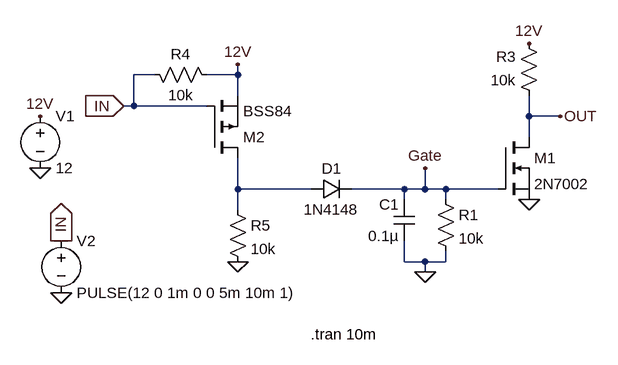
[diagram p0: schematic delay.asc]
delay.asc, the LTspice schematic file:
Version 4
SHEET 1 1112 680
WIRE -368 -16 -400 -16
WIRE -240 -16 -240 -32
WIRE -240 -16 -288 -16
WIRE -240 16 -240 -16
WIRE -400 32 -400 -16
WIRE -400 32 -416 32
WIRE -288 32 -400 32
WIRE 208 48 208 16
WIRE 256 48 208 48
WIRE 208 80 208 48
WIRE -240 160 -240 112
WIRE -128 160 -240 160
WIRE 16 160 -64 160
WIRE 48 160 48 128
WIRE 48 160 16 160
WIRE 80 160 48 160
WIRE 160 160 80 160
WIRE 16 176 16 160
WIRE 80 176 80 160
WIRE -240 192 -240 160
WIRE 16 272 16 240
WIRE 48 272 16 272
WIRE 80 272 80 256
WIRE 80 272 48 272
WIRE 48 288 48 272
FLAG -544 128 0
FLAG -512 320 0
FLAG -544 48 12V
FLAG -512 240 IN
IOPIN -512 240 Out
FLAG 48 288 0
FLAG 208 176 0
FLAG 256 48 OUT
FLAG 208 -64 12V
FLAG -240 -32 12V
FLAG -416 32 IN
IOPIN -416 32 In
FLAG -240 272 0
FLAG 48 128 Gate
SYMBOL voltage -544 32 R0
WINDOW 123 0 0 Left 0
WINDOW 39 0 0 Left 0
SYMATTR InstName V1
SYMATTR Value 12
SYMBOL voltage -512 224 R0
WINDOW 123 0 0 Left 0
WINDOW 39 0 0 Left 0
SYMATTR InstName V2
SYMATTR Value PULSE(12 0 1m 0 0 5m 10m 1)
SYMBOL diode -128 176 R270
WINDOW 0 32 32 VTop 2
WINDOW 3 0 32 VBottom 2
SYMATTR InstName D1
SYMATTR Value 1N4148
SYMBOL cap 32 176 M0
SYMATTR InstName C1
SYMATTR Value 0.1µ
SYMBOL res 64 160 R0
SYMATTR InstName R1
SYMATTR Value 10k
SYMBOL nmos 160 80 R0
SYMATTR InstName M1
SYMATTR Value 2N7002
SYMBOL res 224 32 R180
WINDOW 0 36 76 Left 2
WINDOW 3 36 40 Left 2
SYMATTR InstName R3
SYMATTR Value 10k
SYMBOL pmos -288 112 M180
SYMATTR InstName M2
SYMATTR Value BSS84
SYMBOL res -272 0 M270
WINDOW 0 32 56 VTop 2
WINDOW 3 0 56 VBottom 2
SYMATTR InstName R4
SYMATTR Value 10k
SYMBOL res -256 176 R0
SYMATTR InstName R5
SYMATTR Value 10k
TEXT -128 384 Left 2 !.tran 10m

The netlist it stands for:
* delay.asc
V1 12V 0 12
V2 IN 0 PULSE(12 0 1m 0 0 5m 10m 1)
D1 N001 Gate 1N4148
C1 Gate 0 0.1µ
R1 Gate 0 10k
M1 OUT Gate 0 0 2N7002
R3 OUT 12V 10k
M2 N001 IN 12V 12V BSS84
R4 12V IN 10k
R5 N001 0 10k
.model D D
.lib standard.dio
.model NMOS NMOS
.model PMOS PMOS
.lib standard.mos
.tran 10m
.backanno
.end

* Results of the author's LTspice run, read from the files saved beside the schematic
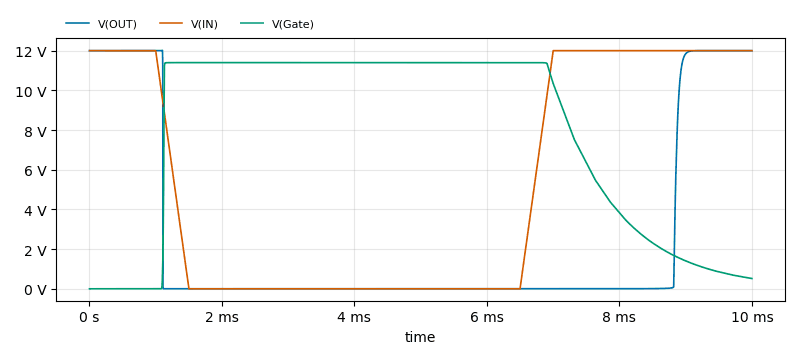
[diagram p1: Transient Analysis of delay.asc, plotted from the saved traces]
* Transient Analysis, 1 run:
*   V(OUT): min 1.476 mV, max 12.01 V, average 2.692 V, rms 5.653 V, last 12 V
*   V(IN): min 0 V, max 12 V, average 5.4 V, rms 7.9 V, last 12 V
*   V(Gate): min 0 V, max 11.4 V, average 7.689 V, rms 9.04 V, last 518 mV